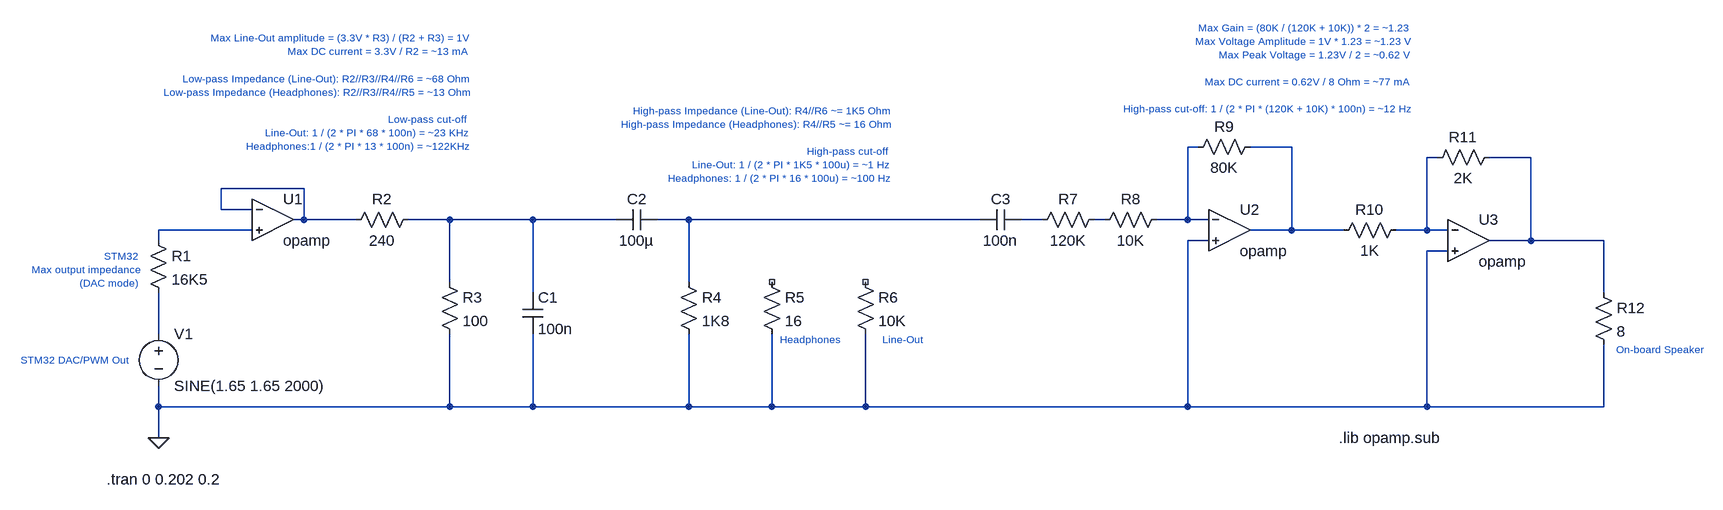
[diagram p0: schematic audio-simulation.asc]
audio-simulation.asc, the LTspice schematic file:
Version 4
SHEET 1 2544 952
WIRE 1376 -144 1360 -144
WIRE 1520 -144 1456 -144
WIRE 1744 -128 1728 -128
WIRE 1888 -128 1824 -128
WIRE 0 -80 -128 -80
WIRE -128 -48 -128 -80
WIRE -80 -48 -128 -48
WIRE 0 -32 0 -80
WIRE 0 -32 -16 -32
WIRE 80 -32 0 -32
WIRE 224 -32 160 -32
WIRE 352 -32 224 -32
WIRE 480 -32 352 -32
WIRE 592 -32 544 -32
WIRE 1040 -32 592 -32
WIRE 1136 -32 1104 -32
WIRE 1232 -32 1216 -32
WIRE 1360 -32 1360 -144
WIRE 1360 -32 1312 -32
WIRE 1392 -32 1360 -32
WIRE -80 -16 -224 -16
WIRE 1520 -16 1520 -144
WIRE 1520 -16 1456 -16
WIRE 1600 -16 1520 -16
WIRE 1728 -16 1728 -128
WIRE 1728 -16 1680 -16
WIRE 1760 -16 1728 -16
WIRE -224 0 -224 -16
WIRE 1392 0 1360 0
WIRE 1888 0 1888 -128
WIRE 1888 0 1824 0
WIRE 2000 0 1888 0
WIRE 1760 16 1728 16
WIRE 224 64 224 -32
WIRE 592 64 592 -32
WIRE 352 80 352 -32
WIRE 2000 80 2000 0
WIRE -224 144 -224 80
WIRE -224 256 -224 224
WIRE 224 256 224 144
WIRE 224 256 -224 256
WIRE 352 256 352 144
WIRE 352 256 224 256
WIRE 592 256 592 144
WIRE 592 256 352 256
WIRE 720 256 720 144
WIRE 720 256 592 256
WIRE 864 256 864 144
WIRE 864 256 720 256
WIRE 1360 256 1360 0
WIRE 1360 256 864 256
WIRE 1728 256 1728 16
WIRE 1728 256 1360 256
WIRE 2000 256 2000 160
WIRE 2000 256 1728 256
WIRE -224 304 -224 256
FLAG -224 304 0
SYMBOL res -240 -16 R0
SYMATTR InstName R1
SYMATTR Value 16K5
SYMBOL res 208 48 R0
SYMATTR InstName R3
SYMATTR Value 100
SYMBOL voltage -224 128 R0
WINDOW 123 0 0 Left 0
WINDOW 39 0 0 Left 0
SYMATTR InstName V1
SYMATTR Value SINE(1.65 1.65 2000)
SYMBOL res 176 -48 R90
WINDOW 0 0 56 VBottom 2
WINDOW 3 32 56 VTop 2
SYMATTR InstName R2
SYMATTR Value 240
SYMBOL cap 336 80 R0
SYMATTR InstName C1
SYMATTR Value 100n
SYMBOL cap 544 -48 R90
WINDOW 0 0 32 VBottom 2
WINDOW 3 32 32 VTop 2
SYMATTR InstName C2
SYMATTR Value 100µ
SYMBOL res 576 48 R0
SYMATTR InstName R4
SYMATTR Value 1K8
SYMBOL res 704 48 R0
SYMATTR InstName R5
SYMATTR Value 16
SYMBOL res 848 48 R0
SYMATTR InstName R6
SYMATTR Value 10K
SYMBOL res 1328 -48 R90
WINDOW 0 0 56 VBottom 2
WINDOW 3 32 56 VTop 2
SYMATTR InstName R8
SYMATTR Value 10K
SYMBOL res 1472 -160 R90
WINDOW 0 0 56 VBottom 2
WINDOW 3 32 56 VTop 2
SYMATTR InstName R9
SYMATTR Value 80K
SYMBOL res 1232 -48 R90
WINDOW 0 0 56 VBottom 2
WINDOW 3 32 56 VTop 2
SYMATTR InstName R7
SYMATTR Value 120K
SYMBOL cap 1104 -48 R90
WINDOW 0 0 32 VBottom 2
WINDOW 3 32 32 VTop 2
SYMATTR InstName C3
SYMATTR Value 100n
SYMBOL res 1696 -32 R90
WINDOW 0 0 56 VBottom 2
WINDOW 3 32 56 VTop 2
SYMATTR InstName R10
SYMATTR Value 1K
SYMBOL res 1840 -144 R90
WINDOW 0 0 56 VBottom 2
WINDOW 3 32 56 VTop 2
SYMATTR InstName R11
SYMATTR Value 2K
SYMBOL res 1984 64 R0
SYMATTR InstName R12
SYMATTR Value 8
SYMBOL Opamps\\opamp 1424 -80 R0
SYMATTR InstName U2
SYMBOL Opamps\\opamp 1792 -64 R0
SYMATTR InstName U3
SYMBOL Opamps\\opamp -48 -96 R0
SYMATTR InstName U1
TEXT -256 24 Right 1 ;STM32\nMax output impedance\n(DAC mode)
TEXT 824 152 Right 1 ;Headphones
TEXT 952 152 Right 1 ;Line-Out
TEXT -272 184 Right 1 ;STM32 DAC/PWM Out
TEXT 248 -312 Right 1 ;Max Line-Out amplitude = (3.3V * R3) / (R2 + R3) = 1V\nMax DC current = 3.3V / R2 = ~13 mA\n \nLow-pass Impedance (Line-Out): R2//R3//R4//R6 = ~68 Ohm\nLow-pass Impedance (Headphones): R2//R3//R4//R5 = ~13 Ohm\n \nLow-pass cut-off\nLine-Out: 1 / (2 * PI * 68 * 100n) = ~23 KHz\nHeadphones:1 / (2 * PI * 13 * 100n) = ~122KHz
TEXT 896 -200 Right 1 ;High-pass Impedance (Line-Out): R4//R6 ~= 1K5 Ohm\nHigh-pass Impedance (Headphones): R4//R5 ~= 16 Ohm\n \nHigh-pass cut-off\nLine-Out: 1 / (2 * PI * 1K5 * 100u) = ~1 Hz\nHeadphones: 1 / (2 * PI * 16 * 100u) = ~100 Hz
TEXT 2152 168 Right 1 ;On-board Speaker
TEXT 1592 304 Left 2 !.lib opamp.sub
TEXT -304 368 Left 2 !.tran 0 0.202 0.2
TEXT 1696 -328 Right 1 ;Max Gain = (80K / (120K + 10K)) * 2 = ~1.23\nMax Voltage Amplitude = 1V * 1.23 = ~1.23 V\nMax Peak Voltage = 1.23V / 2 = ~0.62 V\n \nMax DC current = 0.62V / 8 Ohm = ~77 mA\n \nHigh-pass cut-off: 1 / (2 * PI * (120K + 10K) * 100n) = ~12 Hz

The netlist it stands for:
* audio-simulation.asc
R1 N010 N011 16K5
R3 N006 0 100
V1 N011 0 SINE(1.65 1.65 2000)
R2 N006 N005 240
C1 N006 0 100n
C2 N007 N006 100µ
R4 N007 0 1K8
R5 NC_01 0 16
R6 NC_02 0 10K
R8 N001 N009 10K
R9 N002 N001 80K
R7 N009 N008 120K
C3 N008 N007 100n
R10 N003 N002 1K
R11 N004 N003 2K
R12 N004 0 8
XU2 N001 0 N002 opamp Aol=100K GBW=10Meg  ; pins invin noninvin out
XU3 N003 0 N004 opamp Aol=100K GBW=10Meg  ; pins invin noninvin out
XU1 N005 N010 N005 opamp Aol=100K GBW=10Meg  ; pins invin noninvin out
* STM32
* Max output impedance
* (DAC mode)
* Headphones
* Line-Out
* STM32 DAC/PWM Out
* Max Line-Out amplitude = (3.3V * R3) / (R2 + R3) = 1V
* Max DC current = 3.3V / R2 = ~13 mA
* Low-pass Impedance (Line-Out): R2//R3//R4//R6 = ~68 Ohm
* Low-pass Impedance (Headphones): R2//R3//R4//R5 = ~13 Ohm
* Low-pass cut-off
* Line-Out: 1 / (2 * PI * 68 * 100n) = ~23 KHz
* Headphones:1 / (2 * PI * 13 * 100n) = ~122KHz
* High-pass Impedance (Line-Out): R4//R6 ~= 1K5 Ohm
* High-pass Impedance (Headphones): R4//R5 ~= 16 Ohm
* High-pass cut-off
* Line-Out: 1 / (2 * PI * 1K5 * 100u) = ~1 Hz
* Headphones: 1 / (2 * PI * 16 * 100u) = ~100 Hz
* On-board Speaker
.lib opamp.sub
.tran 0 0.202 0.2
* Max Gain = (80K / (120K + 10K)) * 2 = ~1.23
* Max Voltage Amplitude = 1V * 1.23 = ~1.23 V
* Max Peak Voltage = 1.23V / 2 = ~0.62 V
* Max DC current = 0.62V / 8 Ohm = ~77 mA
* High-pass cut-off: 1 / (2 * PI * (120K + 10K) * 100n) = ~12 Hz
.backanno
.end